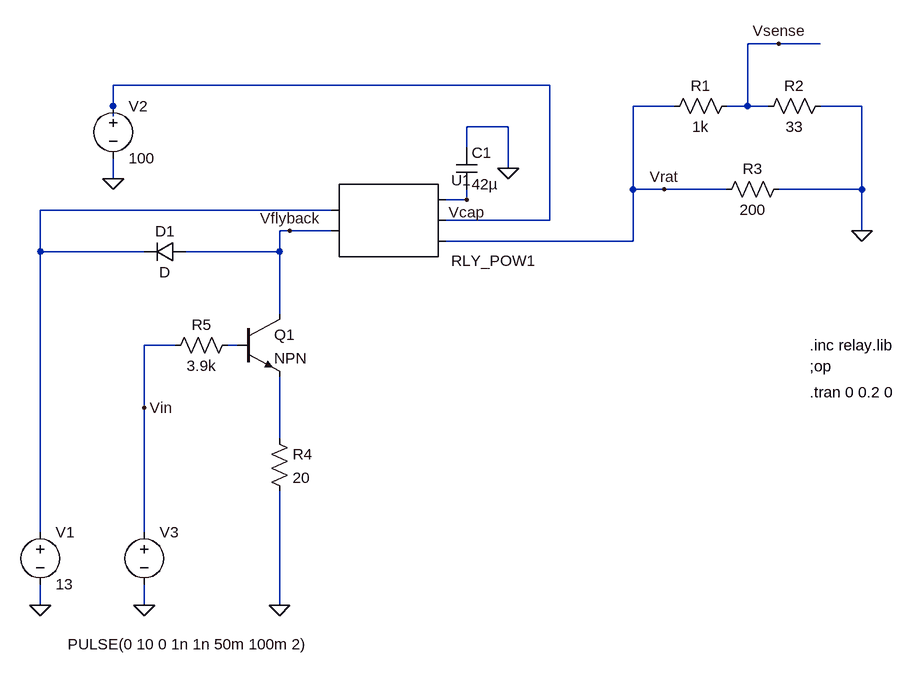
[diagram p0: schematic simple_relay_00.asc]
simple_relay_00.asc, the LTspice schematic file:
Version 4
SHEET 1 880 680
WIRE 416 -320 368 -320
WIRE 480 -320 416 -320
WIRE 64 -256 -608 -256
WIRE -608 -224 -608 -256
WIRE 256 -224 192 -224
WIRE 368 -224 368 -320
WIRE 368 -224 336 -224
WIRE 400 -224 368 -224
WIRE 544 -224 480 -224
WIRE -608 -208 -608 -224
WIRE 0 -192 -64 -192
WIRE -64 -160 -64 -192
WIRE 0 -128 0 -192
WIRE -608 -112 -608 -144
WIRE 192 -96 192 -224
WIRE 240 -96 192 -96
WIRE 336 -96 240 -96
WIRE 544 -96 544 -224
WIRE 544 -96 416 -96
WIRE -64 -80 -64 -96
WIRE -64 -80 -96 -80
WIRE -272 -64 -720 -64
WIRE 64 -48 64 -256
WIRE 64 -48 -96 -48
WIRE -336 -32 -352 -32
WIRE -272 -32 -336 -32
WIRE 544 -32 544 -96
WIRE 192 -16 192 -96
WIRE 192 -16 -96 -16
WIRE -720 0 -720 -64
WIRE -560 0 -720 0
WIRE -352 0 -352 -32
WIRE -352 0 -496 0
WIRE -352 96 -352 0
WIRE -512 144 -560 144
WIRE -416 144 -432 144
WIRE -560 240 -560 144
WIRE -352 288 -352 192
WIRE -720 432 -720 0
WIRE -560 432 -560 240
WIRE -720 544 -720 512
WIRE -560 544 -560 512
WIRE -352 544 -352 368
FLAG -608 -112 0
FLAG 0 -128 0
FLAG 544 -32 0
FLAG -560 544 0
FLAG -720 544 0
FLAG -352 544 0
FLAG 416 -320 Vsense
FLAG -336 -32 Vflyback
FLAG 240 -96 Vrat
FLAG -560 240 Vin
FLAG -64 -80 Vcap
SYMBOL AutoGenerated\\RLY_POW1 -192 -48 R0
SYMATTR InstName U1
SYMBOL voltage -608 -240 R0
WINDOW 123 0 0 Left 2
WINDOW 39 0 0 Left 2
SYMATTR InstName V2
SYMATTR Value 100
SYMBOL cap -80 -160 R0
SYMATTR InstName C1
SYMATTR Value 42µ
SYMBOL res 352 -240 R90
WINDOW 0 0 56 VBottom 2
WINDOW 3 32 56 VTop 2
SYMATTR InstName R1
SYMATTR Value 1k
SYMBOL res 496 -240 R90
WINDOW 0 0 56 VBottom 2
WINDOW 3 32 56 VTop 2
SYMATTR InstName R2
SYMATTR Value 33
SYMBOL res 432 -112 R90
WINDOW 0 0 56 VBottom 2
WINDOW 3 32 56 VTop 2
SYMATTR InstName R3
SYMATTR Value 200
SYMBOL voltage -560 416 R0
WINDOW 3 -118 188 Left 2
WINDOW 123 0 0 Left 2
WINDOW 39 0 0 Left 2
SYMATTR InstName V3
SYMATTR Value PULSE(0 10 0 1n 1n 50m 100m 2)
SYMBOL npn -416 96 R0
SYMATTR InstName Q1
SYMBOL voltage -720 416 R0
WINDOW 123 0 0 Left 2
WINDOW 39 0 0 Left 2
SYMATTR InstName V1
SYMATTR Value 13
SYMBOL res -368 272 R0
SYMATTR InstName R4
SYMATTR Value 20
SYMBOL res -416 128 R90
WINDOW 0 0 56 VBottom 2
WINDOW 3 32 56 VTop 2
SYMATTR InstName R5
SYMATTR Value 3.9k
SYMBOL diode -496 -16 R90
WINDOW 0 0 32 VBottom 2
WINDOW 3 32 32 VTop 2
SYMATTR InstName D1
TEXT 464 144 Left 2 !.inc relay.lib
TEXT 464 176 Left 2 !;op
TEXT 464 216 Left 2 !.tran 0 0.2 0

The netlist it stands for:
* simple_relay_00.asc
* U1: RLY_POW1 (symbol AutoGenerated\RLY_POW1 not available, pins judged from their places): pin1=N002 pin2=Vflyback pin3=Vcap pin4=N001 pin5=Vrat
V2 N001 0 100
C1 0 Vcap 42µ
R1 Vsense Vrat 1k
R2 0 Vsense 33
R3 0 Vrat 200
V3 Vin 0 PULSE(0 10 0 1n 1n 50m 100m 2)
Q1 Vflyback N003 N004 0 NPN
V1 N002 0 13
R4 N004 0 20
R5 N003 Vin 3.9k
D1 Vflyback N002 D
.model D D
.lib standard.dio
.model NPN NPN
.model PNP PNP
.lib standard.bjt
.inc relay.lib
;op
.tran 0 0.2 0
.backanno
.end